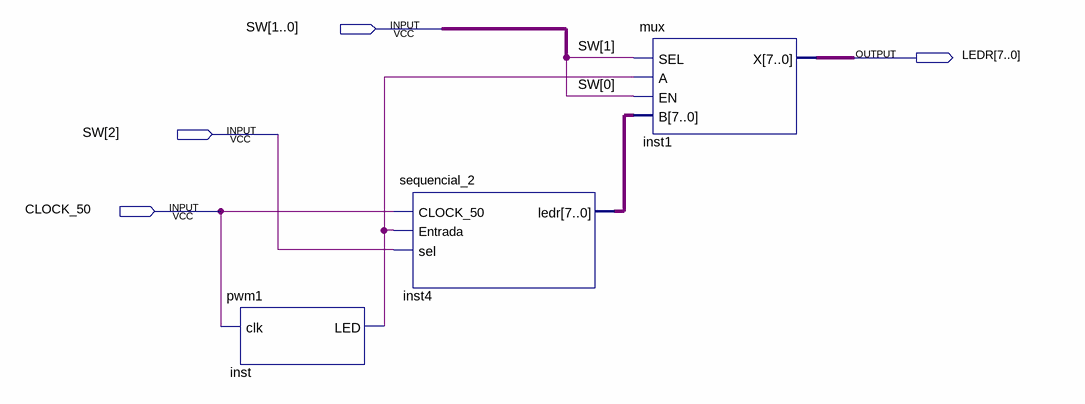
[diagram p0: schematic sheet]
// Quartus schematic exercicio_3.bdf as structural Verilog: 3 symbols, 4 pins
module exercicio_3 (
  input  [2:0] SW,
  input  CLOCK_50,
  output [7:0] LEDR
);

  wire inst_led;
  wire [7:0] inst4_ledr;

  pwm1 inst (.clk(CLOCK_50), .LED(inst_led));
  sequencial_2 inst4 (.CLOCK_50(CLOCK_50), .Entrada(inst_led), .sel(SW[2]), .ledr(inst4_ledr));
  mux inst1 (.SEL(SW[1]), .A(inst_led), .EN(SW[0]), .B(inst4_ledr), .X(LEDR));
endmodule
